# Altium schematic sheet High Precision Laboratory Voltage Calibrator.SchDoc: High Precision Laboratory Voltage Calibrator
size A4; DrawnBy: Oktay Yazgac Eng. Ph.D.; Organization: Yazgac Research; Address1: Kamelya1-3, Daire 3, Ataşehir; Address2: 34758, İstanbul, Turkey; DocumentNumber: HPL-VC-1; Revision: R01; Page: 1; PageTotal: 1
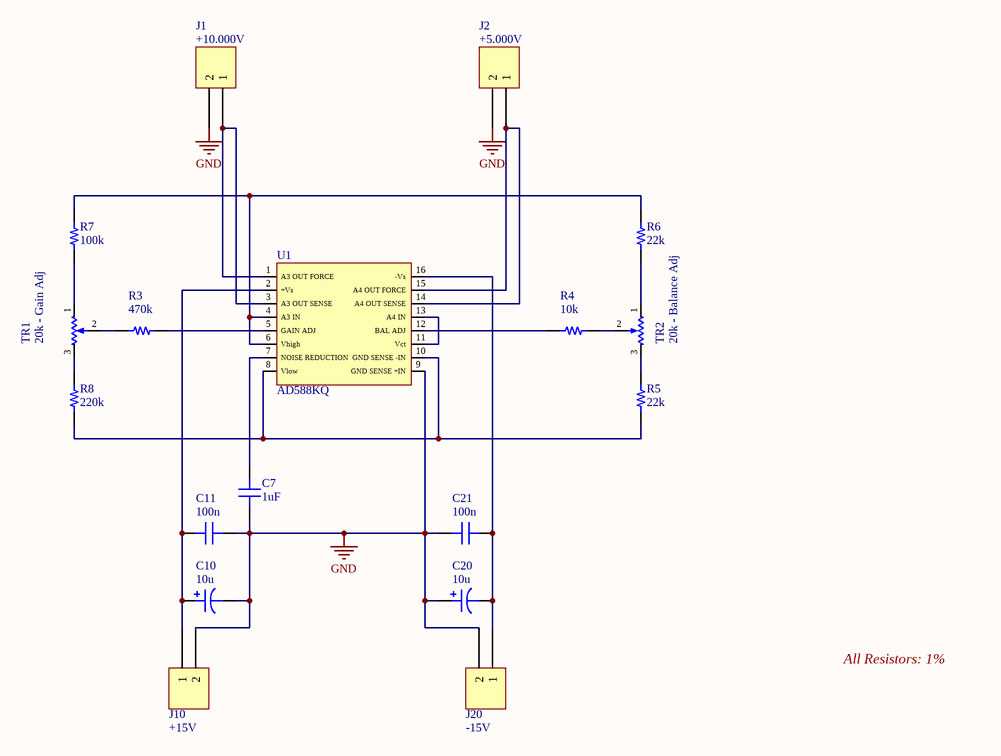
[diagram p0: High Precision Laboratory Voltage Calibrator.SchDoc]

## Parts
C7  1uF  [CAP 0805/2012]
C10  10u  [RB.2/.4-CAP-POL]
C11  100n  [CAP 0805/2012]
C20  10u  [RB.2/.4-CAP-POL]
C21  100n  [CAP 0805/2012]
J1  +10.000V  [SAMTEC SSW-102-03-T-S]
J2  +5.000V  [SAMTEC SSW-102-03-T-S]
J10  +15V  [SAMTEC SSW-102-03-T-S]
J20  -15V  [SAMTEC SSW-102-03-T-S]
R3  470k  [RES 0805/2012]
R4  10k  [RES 0805/2012]
R5  22k  [RES 0805/2012]
R6  22k  [RES 0805/2012]
R7  100k  [RES 0805/2012]
R8  220k  [RES 0805/2012]
TR1  20k - Gain Adj  [Bourns 3296w]
TR2  20k - Balance Adj  [Bourns 3296w]
U1  AD588KQ  [DIP16-300]

## Nets
GND: C7.1 C10.2 C11.1 C20.1 C21.2 J1.2 J2.2 J10.2 J20.2 U1.9(GND_SENSE_+IN)
NetC7_2: C7.2 U1.7(NOISE_REDUCTION)
NetC10_1: C10.1 C11.2 J10.1 U1.2(+Vs)
NetC20_2: C20.2 C21.1 J20.1 U1.16(-Vs)
NetJ1_1: J1.1 U1.1(A3_OUT_FORCE) U1.3(A3_OUT_SENSE)
NetJ2_1: J2.1 U1.14(A4_OUT_SENSE) U1.15(A4_OUT_FORCE)
NetR3_1: R3.1 U1.5(GAIN_ADJ)
NetR3_2: R3.2 TR1.2
NetR4_1: R4.1 TR2.2
NetR4_2: R4.2 U1.12(BAL_ADJ)
NetR5_1: R5.1 R8.1 U1.8(Vlow) U1.10(GND_SENSE_-IN)
NetR5_2: R5.2 TR2.3
NetR6_1: R6.1 TR2.1
NetR6_2: R6.2 R7.2 U1.4(A3_IN) U1.6(Vhigh)
NetR7_1: R7.1 TR1.1
NetR8_2: R8.2 TR1.3
NetU1_11: U1.11(Vct) U1.13(A4_IN)

## Notes on the sheet
- All Resistors: 1%
- Title
- Drawn By:
- Size:
- A4
- Number:
- Revision:
- Page:
- of
- File:
- Date:

## Library data of the parts
C7 C11 C21 = Capacitor: SMT Capacitor; Value: 0.1uF
C10 C20 = Capacitor POL RAD: RAD Polarised Capacitor; Value: 10uF
J1 J2 J10 J20 = 1x2 Pin Header - SAMTEC SULLINS
R3-R8 = Resistor: SMT Resistor; Value: 1K
TR1 TR2 = Trimmers 1
U1 = AD588KQ: Multiple Output, High Precision, / Dual-Tracking Reference